# EAGLE schematic Williamson88 (EAGLE 9.1.3)
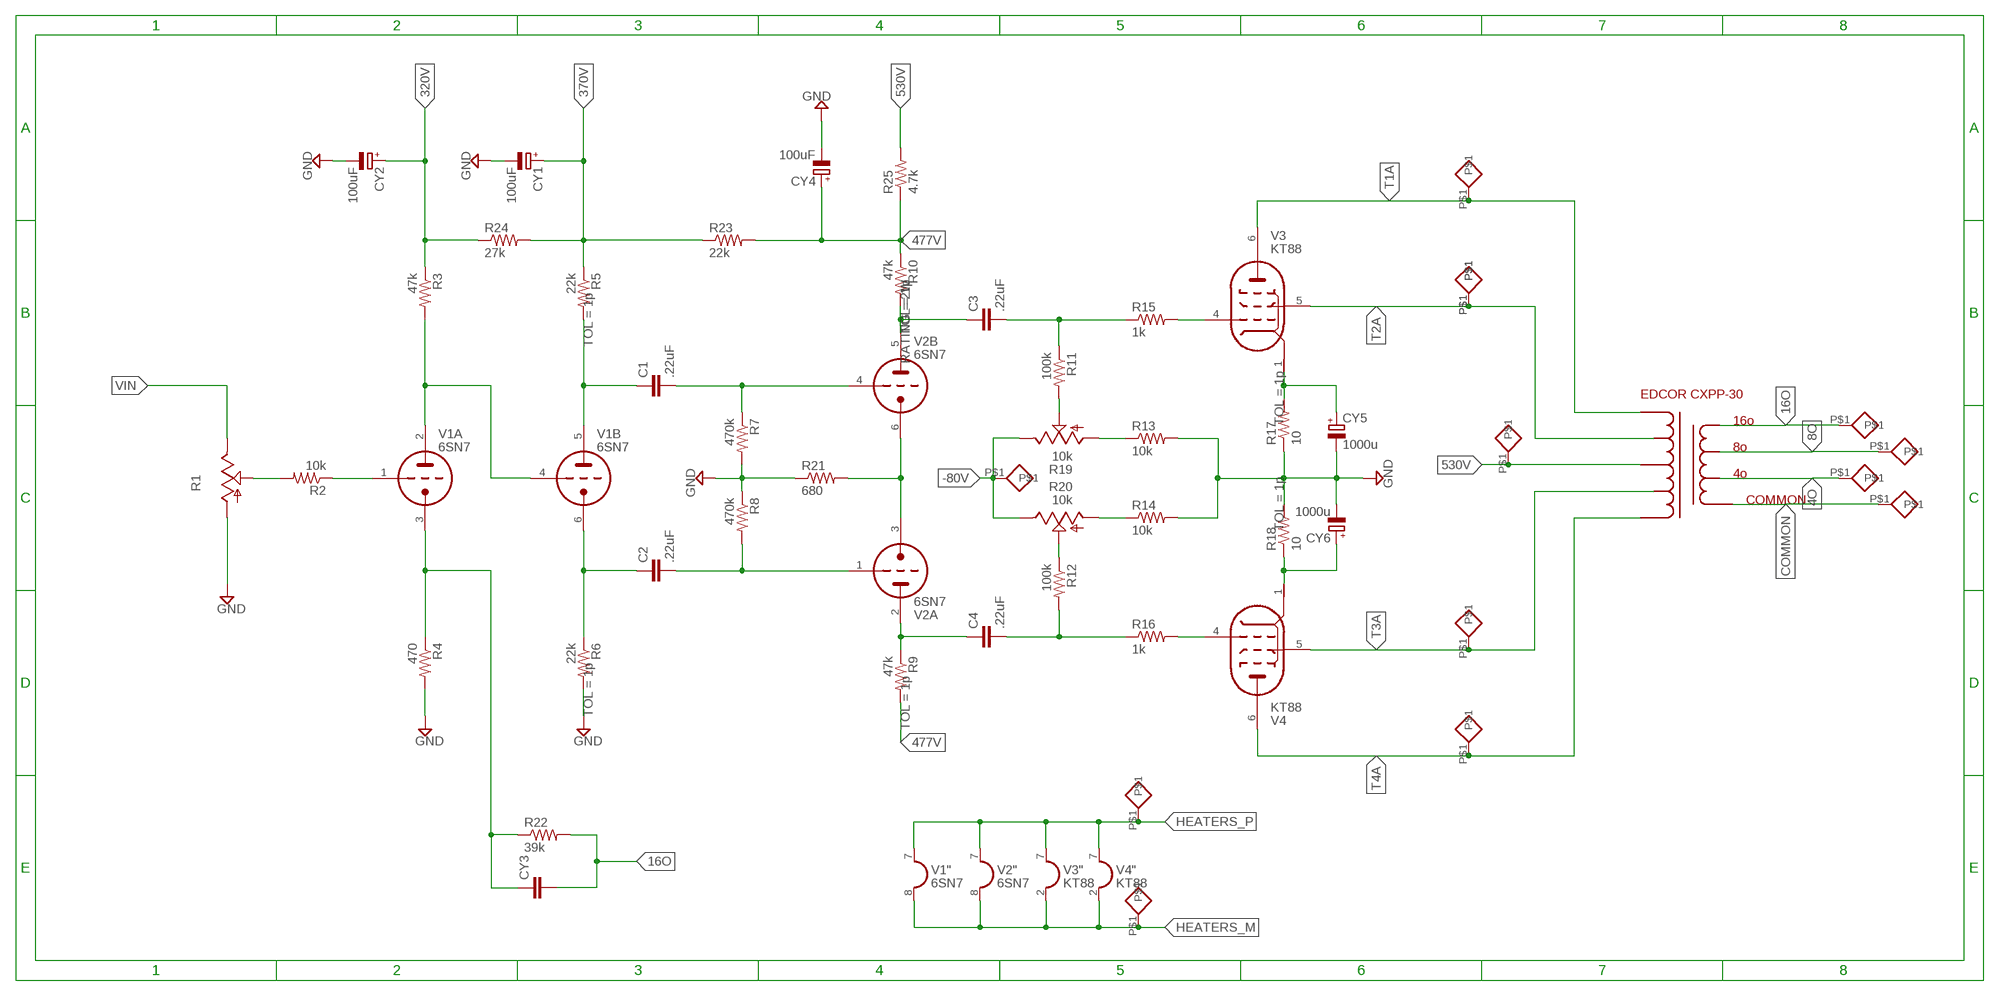
[diagram p0: schematic, sheet 1]

## Parts
C1  .22uF  C-EU225-062X268  [C225-062X268]
C2  .22uF  C-EU225-062X268  [C225-062X268]
C3  .22uF  C-EU225-062X268  [C225-062X268]
C4  .22uF  C-EU225-062X268  [C225-062X268]
CY1  100uF  CPOL-EUE7.5-18  [E7,5-18]
CY2  100uF  CPOL-EUE7.5-18  [E7,5-18]
CY3  CYYC10B5  [YC10B5]
CY4  100uF  CPOL-EUE7.5-18  [E7,5-18]
CY5  1000u  CPOL-EUE7.5-18  [E7,5-18]
CY6  1000u  CPOL-EUE7.5-18  [E7,5-18]
R1  TRIM_US-B25P  [B25P]
R2  10k  R-US_0309/10  [0309/10]
R3  47k  R-US_0309/10  [0309/10]
R4  470  R-US_0309/10  [0309/10]
R5  22k  R-US_0309/10  [0309/10]
R6  22k  R-US_0309/10  [0309/10]
R7  470k  R-US_0309/10  [0309/10]
R8  470k  R-US_0309/10  [0309/10]
R9  47k  R-US_0309/10  [0309/10]
R10  47k  R-US_0309/10  [0309/10]
R11  100k  R-US_0309/10  [0309/10]
R12  100k  R-US_0309/10  [0309/10]
R13  10k  R-US_0309/10  [0309/10]
R14  10k  R-US_0309/10  [0309/10]
R15  1k  R-US_0309/10  [0309/10]
R16  1k  R-US_0309/10  [0309/10]
R17  10  R-US_0309/10  [0309/10]
R18  10  R-US_0309/10  [0309/10]
R19  10k  TRIM_US-B25P  [B25P]
R20  10k  TRIM_US-B25P  [B25P]
R21  680  R-US_0309/10  [0309/10]
R22  39k  R-US_0309/10  [0309/10]
R23  22k  R-US_0309/10  [0309/10]
R24  27k  R-US_0309/10  [0309/10]
R25  4.7k  R-US_0309/10  [0309/10]
U$1  CXPP30  [CXPP30]
U$2  W_CONN  [WIRE_T]
U$3  W_CONN  [WIRE_T]
U$4  W_CONN  [WIRE_T]
U$5  W_CONN  [WIRE_T]
U$6  W_CONN  [WIRE_T]
U$7  W_CONN  [WIRE_T]
U$8  W_CONN  [WIRE_T]
U$9  W_CONN  [WIRE_T]
U$10  W_CONN  [WIRE_T]
U$14  W_CONN  [WIRE_T]
U$15  W_CONN  [WIRE_T]
U$17  W_CONN  [WIRE_T]
U$18  W_CONN  [WIRE_T]
V1  6SN7  6SN7GT-P  [OKTAL]
V2  6SN7  6SN7GT-P  [OKTAL]
V3  KT88  KT88-P  [OKTAL]
V4  KT88  KT88-P  [OKTAL]

## Nets
4O: U$8.P$1
8O: U$7.P$1
16O: CY3.2 R22.2 U$6.P$1
320V: CY2.+ R3.1 R24.1
370V: CY1.+ R5.1 R23.1 R24.2
477V: CY4.+ R9.2 R10.1 R23.2 R25.1
530V: R25.2 U$18.P$1
-80V: R19.E R20.E U$10.P$1
COMMON: U$9.P$1
GND: CY1.- CY2.- CY4.- CY5.- CY6.- R1.A R4.2 R6.2 R7.2 R8.1 R13.2 R14.2 R17.1 R18.2 R21.1
HEATERS_M: U$15.P$1 V1.8(":H2) V2.8(":H2) V3.2(H2) V4.2(H2)
HEATERS_P: U$14.P$1 V1.7(":H1) V2.7(":H1) V3.7(H1) V4.7(H1)
N$1: R3.2 V1.2(A:TA) V1.4(B:TG)
N$2: CY3.1 R4.1 R22.1 V1.3(A:TK)
N$3: C2.1 R6.1 V1.6(B:TK)
N$4: C1.1 R5.2 V1.5(B:TA)
N$6: C1.2 R7.1 V2.4(B:TG)
N$7: C2.2 R8.2 V2.1(A:TG)
N$8 [LV]: R1.S R2.2
N$9: R21.2 V2.3(A:TK) V2.6(B:TK)
N$10: C3.1 R10.2 V2.5(B:TA)
N$11: C4.1 R9.1 V2.2(A:TA)
N$12: C3.2 R11.1 R15.1
N$13: R15.2 V3.4(PG)
N$14: C4.2 R12.2 R16.1
N$15: R16.2 V4.4(PG)
N$16: CY5.+ R17.2 V3.1(PK)
N$17: CY6.+ R18.1 V4.1(PK)
N$18: R13.1 R19.A
N$19 [LV]: R2.1 V1.1(A:TG)
N$20: R14.1 R20.A
N$21: R12.1 R20.S
N$22: R11.2 R19.S
T1A: U$2.P$1 V3.6(PA)
T2A: U$3.P$1 U$17.P$1 V3.5(PSG)
T3A: U$4.P$1 V4.5(PSG)
T4A: U$5.P$1 V4.6(PA)
VIN [LV]: R1.E

## Library data of the parts
C1-C4 = rcl:C-EU: CAPACITOR, European symbol; MPN: 150224J630LE
CY1 CY2 CY4 = rcl:CPOL-EU: POLARIZED CAPACITOR, European symbol; RATING: 600V
CY3 = rcl:CY: Y CAPACITOR for power line
CY5 CY6 = rcl:CPOL-EU: POLARIZED CAPACITOR, European symbol; RATING: 50V
R1 R19 R20 = pot:TRIM_US-: POTENTIOMETER
R2-R4 R7 R8 R11-R16 R21-R24 = rcl:R-US_: RESISTOR, American symbol
R5 R6 = rcl:R-US_: RESISTOR, American symbol; TOL: 1p
R9 R10 = rcl:R-US_: RESISTOR, American symbol; RATING: 2W; TOL: 1p
R17 R18 = rcl:R-US_: RESISTOR, American symbol; RATING: 5W; TOL: 1p
R25 = rcl:R-US_: RESISTOR, American symbol; RATING: 5W
U$1 = CXPP30:CXPP30: 30W audio transformer
U$2-U$10 U$14 U$15 U$17 U$18 = CXPP30:W_CONN: Wire connection
V1 V2 = tubes:6SN7GT-P
V3 V4 = tubes:KT88-P

## Net classes
0 default: width 0.203 mm, drill 0.254 mm, clearance 0.254 mm
1 LV: width 0.889 mm, drill 0.889 mm, clearance 0.889 mm